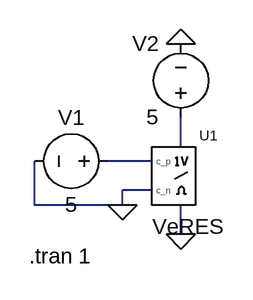
[diagram p0: schematic Draft1.asc]
Draft1.asc, the LTspice schematic file:
Version 4
SHEET 1 880 680
WIRE 240 112 240 80
WIRE 208 128 160 128
WIRE 208 160 176 160
WIRE 80 176 80 128
WIRE 176 176 176 160
WIRE 176 176 80 176
WIRE 240 208 240 176
FLAG 240 208 0
FLAG 176 176 0
FLAG 240 0 0
SYMBOL voltage 176 128 R90
WINDOW 0 -32 56 VBottom 2
WINDOW 3 32 56 VTop 2
WINDOW 123 0 0 Left 0
WINDOW 39 0 0 Left 0
SYMATTR InstName V1
SYMATTR Value 5
SYMBOL voltage 240 96 R180
WINDOW 0 24 96 Left 2
WINDOW 3 24 16 Left 2
WINDOW 123 0 0 Left 0
WINDOW 39 0 0 Left 0
SYMATTR InstName V2
SYMATTR Value 5
SYMBOL ESM\\Ideal\ Components\\VeRES 240 144 R0
SYMATTR InstName U1
TEXT 74 232 Left 2 !.tran 1

The netlist it stands for:
* Draft1.asc
V1 N002 0 5
V2 N001 0 5
XU1 N001 0 N002 0 VeRES  ; pins 1 2 11 12
.tran 1
.lib ESM\Ideal Components\VEQRSIM.cir
.backanno
.end